# EAGLE design RS485 Breakout (EAGLE 9.6.2)
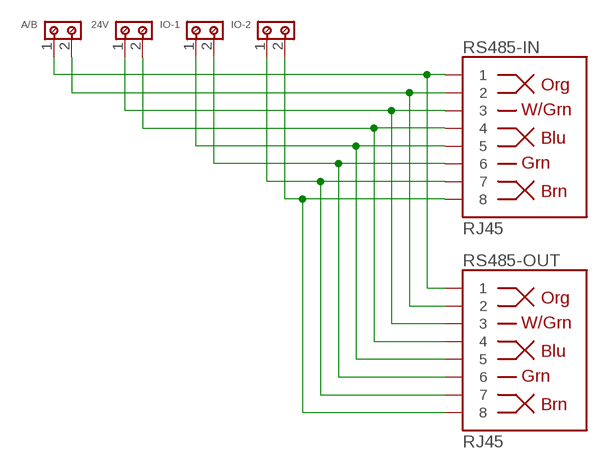
[diagram p0: schematic, sheet 1]

## Parts
24V  691201520002  [691201520002]
A/B  691201520002  [691201520002]
IO-1  691201520002  [691201520002]
IO-2  691201520002  [691201520002]
RS485-IN  RJ45  RJ45-8  [RJ45-8]
RS485-OUT  RJ45  RJ45-8  [RJ45-8]

## Nets
+24: 24V.1 RS485-IN.3 RS485-OUT.3
-24: 24V.2 RS485-IN.4 RS485-OUT.4
A: A/B.1 RS485-IN.1 RS485-OUT.1
B: A/B.2 RS485-IN.2 RS485-OUT.2
IO0: IO-1.2 RS485-IN.6 RS485-OUT.6
IO1: IO-1.1 RS485-IN.5 RS485-OUT.5
IO2: IO-2.2 RS485-IN.8 RS485-OUT.8
IO3: IO-2.1 RS485-IN.7 RS485-OUT.7

## Library data of the parts
24V A/B IO-1 IO-2 = Wurth_Connectors_WR-TBL Rising Cage Clamp:691201520002: WR-TBL Serie 2015 - 5.08 mm 45° Entry Modular w. Rising Cage Clamp KIND PROPERTIES Pitch 5.08 mm MATERIAL PROPERTIES Insulator Material PA66 Insulator Flammability Rating UL94 V-0 Contact Material Steel Contact Plating Zinc Contact Type Stamped Terminal Screw Material Steel Terminal Screw Plating Zinc Wire Guard Material Copper Alloy GENERAL INFORMATION Operating Temperature -30 up to +120 °C Compliance ROHS & Reach ELECTRICAL PROPERTIES IR UL 16 A IR VDE 24 A Working Voltage [UL] 300 V (AC) Working Voltage [VDE] 130 V (AC) Withstanding Voltage [UL] 1600 V (AC) Withstanding Voltage [VDE] 1250 V (AC) Contact Resistance 20 mΩ MECHANICAL PROPERTIES Wire Strip Length 6 Screw M3 CERTIFICATION UL Approval E150931 VDE Approval 40022115 PACKAGING PROPERTIES Packaging Box <https://www.we-online.com/catalog/media/o32804v209%20Family_WR-TBL2_Series2015.jpg> Details see: https://www.we-online.com/catalog/en/TBL_5_08_2015_45-DEGREE_ENTRY_W_RISING_CAGE_69120152000x/ Updated by Ella Wu 2019-11-25 2019(C) Wurth Elektronik; IR-UL: 16A; IR-VDE: 24A; PART-NUMBER: 691201520002; PINS: 2; PITCH: 5.08mm; TYPE: 45°; WIRE: 12 to 30 (AWG) 3.31 to 0.0509 (mm²); WORKING-VOLTAGE-UL: 300V (AC); WORKING-VOLTAGE-VDE: 130V (AC)
RS485-IN RS485-OUT = SparkFun-Connectors:RJ45-8: RJ45 Jack - 8 pin Simple RJ45, 8-pin connection. Commonly used for Cat5, Cat5e, and Cat6 Ethernet cables. Here is the connector we sell at SparkFun: RJ45 8-Pin Connector <https://www.sparkfun.com/products/643> (PRT-00643) Datasheet <https://cdn.sparkfun.com/datasheets/Prototyping/04908.pdf> It is used on this SparkFun product: SparkFun RJ45 Breakout <https://www.sparkfun.com/products/716> (BOB-00716) Note, you may also be interested in the "MAGJACK" version of this. It is basically a RJ45 connector, but also has some status LEDs built into the connector housing. You can check that out in this library at the device named "MAGJACK.dev" and see these products online: RJ45 Ethernet MagJack-Compatible <https://www.sparkfun.com/products/8534> (PRT-08534) SparkFun RJ45 MagJack Breakout <https://www.sparkfun.com/products/13021> (BOB-13021); PROD_ID: CONN-08506; SF_ID: PRT-00643

## Board
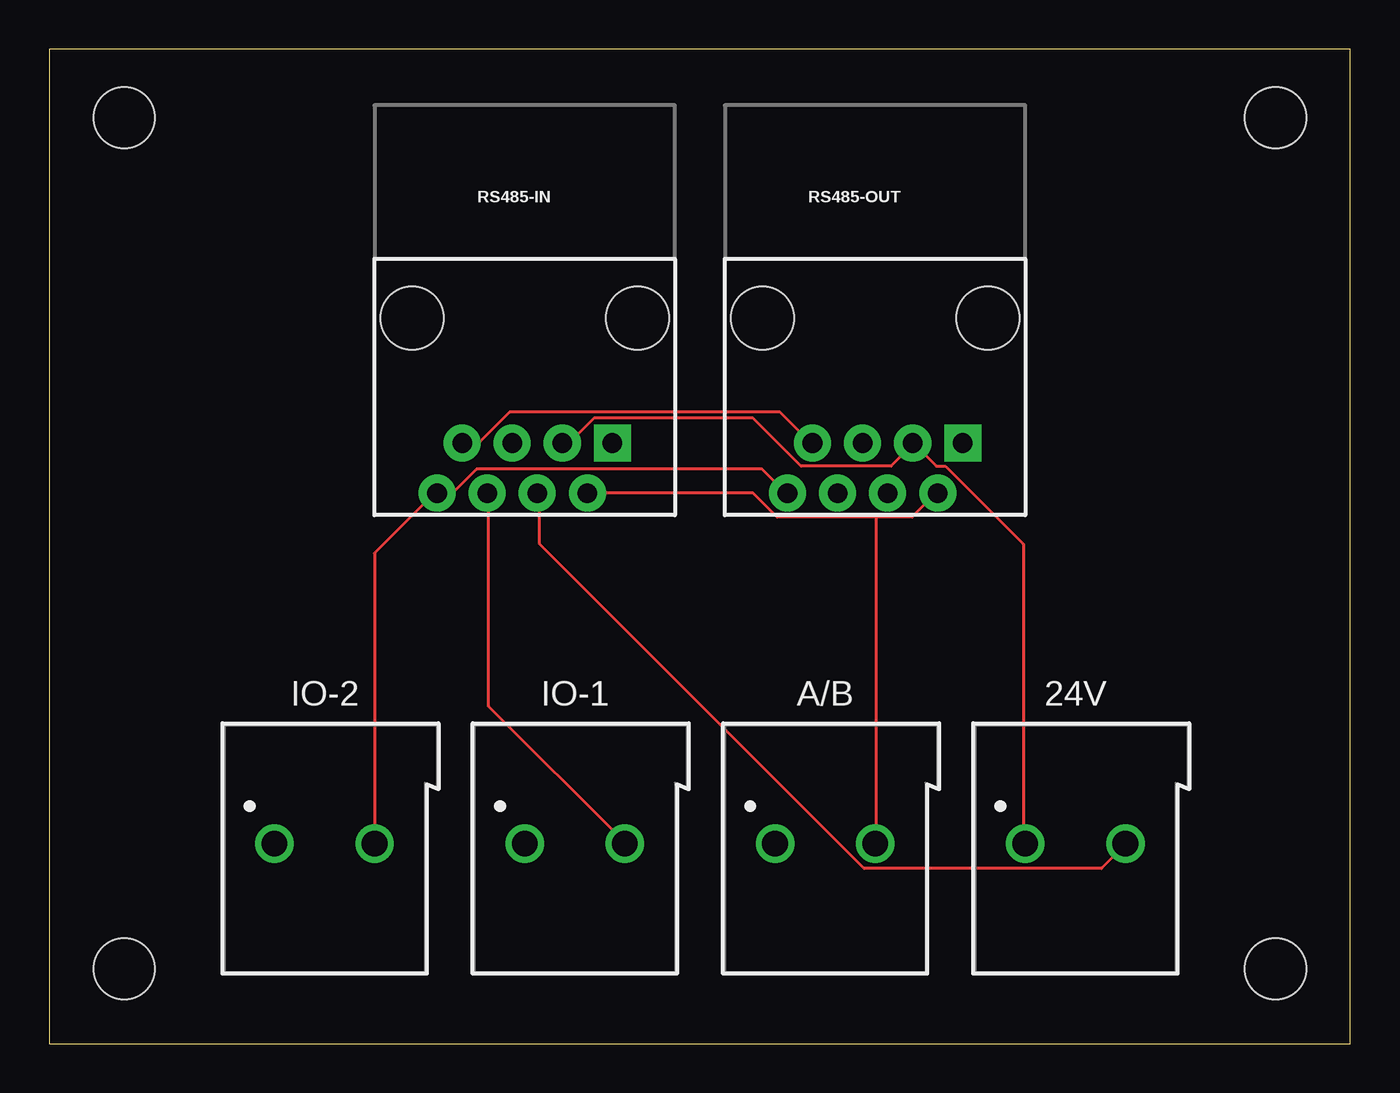
[diagram p1: board, top side]
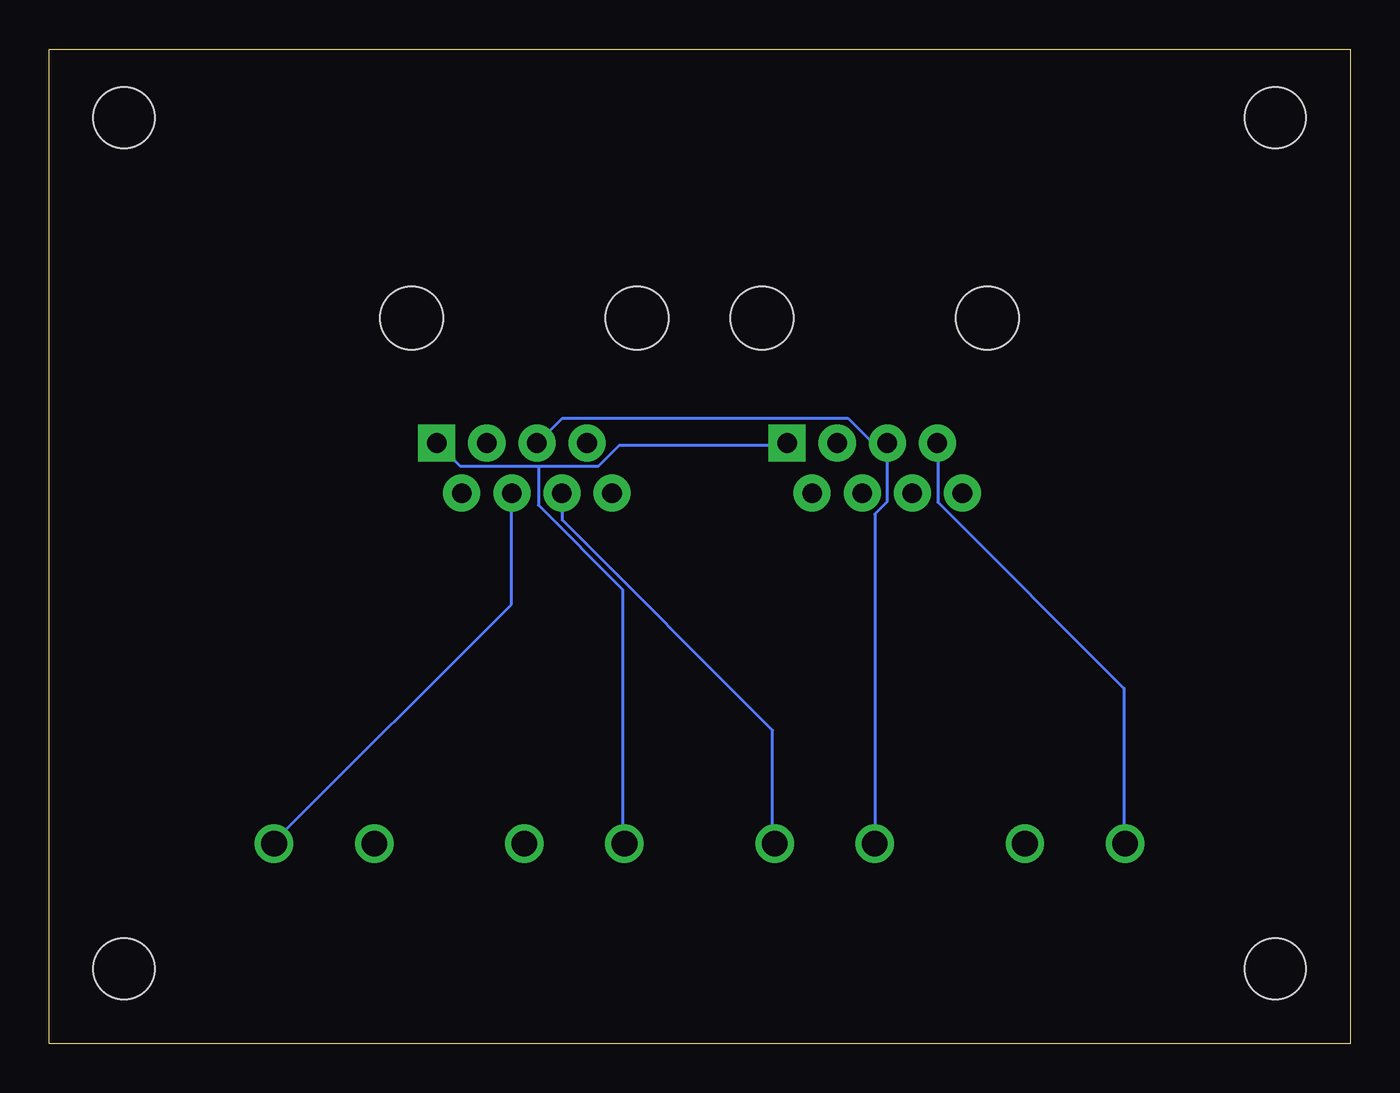
[diagram p2: board, bottom side, seen from below]

Size 66.02 x 50.47 mm. Coordinates in mm from the lower left corner, seen from the top.
Outline: 0,0 66.02,0 66.02,50.47 0,50.47 0,0
Copper layers (1*16): Top 0.035mm / dielectric 0.15mm / Bottom 0.035mm
Design rules "default": minimum track width 6mil, minimum drill 0.35mm, track to track 6mil, track to pad 6mil, pad to pad 6mil, via to via 6mil, smd to smd 6mil, copper to edge 40mil, drill to drill 6mil, minimum pad ring 10mil, minimum via ring 8mil, stop-mask expansion 4mil, vias tented up to drill 0mil, thermal gap 10mil
Holes 3.1 mm at 3.81,46.99 3.81,3.81 62.23,3.81 62.23,46.99

### Footprints (pad centres in the part's own frame; a part is rotated, then mirrored left to right if it is on the bottom)
691201520002 = drill 1.3: 1 -2.54,0; 2 2.54,0
RJ45-8 = drill 1 pad 1.88 square: 1 -4.445,6.35 | drill 1 pad 1.88: 2 -3.175,8.89; 3 -1.905,6.35; 4 -0.635,8.89; 5 0.635,6.35; 6 1.905,8.89; 7 3.175,6.35; 8 4.445,8.89 | hole 3.2: -5.715,0; 5.715,0

### Placement (x,y rotation side)
24V  52.07,10.16 0 top
A/B  39.37,10.16 0 top
IO-1  26.67,10.16 0 top
IO-2  13.97,10.16 0 top
RS485-IN  24.13,36.83 180 top
RS485-OUT  41.91,36.83 180 top

### Tracks (layer width: path | path; a pad name or v marks a point on that pad's centre or on a via)
+24
  Top 0.152: RS485-IN.3 26.11,30.53 26.42,30.53 27.63,31.75 35.71,31.75 38.15,29.31 42.72,29.31 43.79,30.38 RS485-OUT.3 43.94,30.38 45.01,29.31 45.47,29.31 49.43,25.35 49.43,10.26 24V.1
-24
  Top 0.152: RS485-IN.4 24.89,27.94 24.89,25.35 41.35,8.89 53.39,8.89 54.61,10.11 24V.2
  Bottom 0.152: RS485-OUT.4 42.57,27.94 42.57,22.3 54.61,10.26 24V.2
A
  Bottom 0.152: 41.2,29.31 45.16,29.31 46.23,30.38 RS485-OUT.1 | 41.2,29.31 38.15,29.31 37.08,30.38 28.7,30.38 RS485-IN.1 | 41.2,29.31 41.2,27.33 36.93,23.06 36.93,10.26 A/B.1
B
  Top 0.152: RS485-IN.2 35.71,27.94 36.93,26.72 41.96,26.72 | 41.96,26.72 43.79,26.72 45.01,27.94 RS485-OUT.2 | 41.96,26.72 41.96,10.26 A/B.2
IO0
  Top 0.152: RS485-IN.6 22.3,27.94 22.3,17.12 29.16,10.26 IO-1.2
  Bottom 0.152: RS485-OUT.6 39.98,27.94 39.98,26.57 29.31,15.9 29.31,10.26 IO-1.2
IO1
  Bottom 0.152: RS485-OUT.5 41.2,30.53 39.98,31.75 25.5,31.75 24.28,30.53 23.52,30.53 RS485-IN.5 23.52,30.38 23.52,27.48 24.13,26.87 IO-1.1
IO2
  Top 0.152: RS485-OUT.8 37.39,27.94 36.17,29.16 21.69,29.16 20.47,27.94 RS485-IN.8 19.56,27.94 16.51,24.89 IO-2.2
IO3
  Top 0.152: RS485-IN.7 21.08,30.53 21.84,30.53 23.37,32.05 37.08,32.05 38.61,30.53 RS485-OUT.7
  Bottom 0.152: IO-2.1 11.48,10.26 11.48,18.03 20.93,27.48 20.93,30.38 RS485-IN.7